# Altium schematic sheet Temperature Controller.SchDoc
size A4
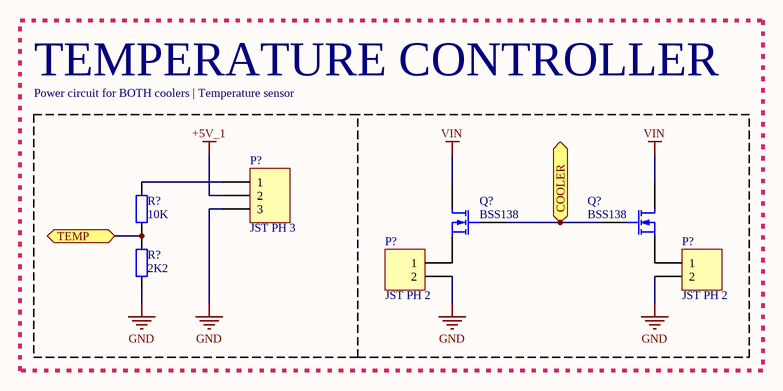
[diagram p0: Temperature Controller.SchDoc]

## Parts
(Parts that share a designator on the sheet are numbered #1, #2 ... from top to bottom, then left to right.)
P?#1  JST PH 3  [B3B-PH-K]
P?#2  JST PH 2  [B2B-PH-K]
P?#3  JST PH 2  [B2B-PH-K]
Q?#1  BSS138  [SOT23]
Q?#2  BSS138  [SOT23]
R?#1  10K  [RES1206]
R?#2  2K2  [RES1206]

## Blocks framed on the sheet
TEMPERATURE CONTROLLER: P?#2 P?#3 Q?#1 Q?#2
Power circuit for BOTH coolers | Temperature sensor: P?#1 R?#1 R?#2

## Ports
COOLER, TEMP

## Nets
+5V_1: P?#1.2
GND: P?#1.3 P?#2.2 P?#3.2 R?#2.1
VIN: Q?#1.1(D) Q?#2.1(D)
COOLER: Q?#1.3(G) Q?#2.3(G) ; port COOLER
TEMP: R?#1.1 R?#2.2 ; port TEMP
NetP?#1_1: P?#1.1 R?#1.2
NetP?#2_1: P?#2.1 Q?#1.2(S)
NetP?#3_1: P?#3.1 Q?#2.2(S)

## Library data of the parts
Q?#1 Q?#2 = BSS138: N-Channel Enhancement Mode Vertical DMOS FET; Published: 17-Dec-2003; DatasheetVersion: Mar-96; PackageVersion: 1996; PackageReference: SOT23; Publisher: Altium Limited; PackageDescription: SOT-23; 3 Leads; Body 3.1 x 2.5 mm, inc. leads (LxW max), Alternate Lead Configuration; ComponentLink1Description: Manufacturer Link; ComponentLink1URL: http://www.zetex.com/; ComponentLink2Description: Datasheet; ComponentLink2URL: www.zetex.com/3.0/pdf/BSS138.pdf
R?#1 R?#2 = RES